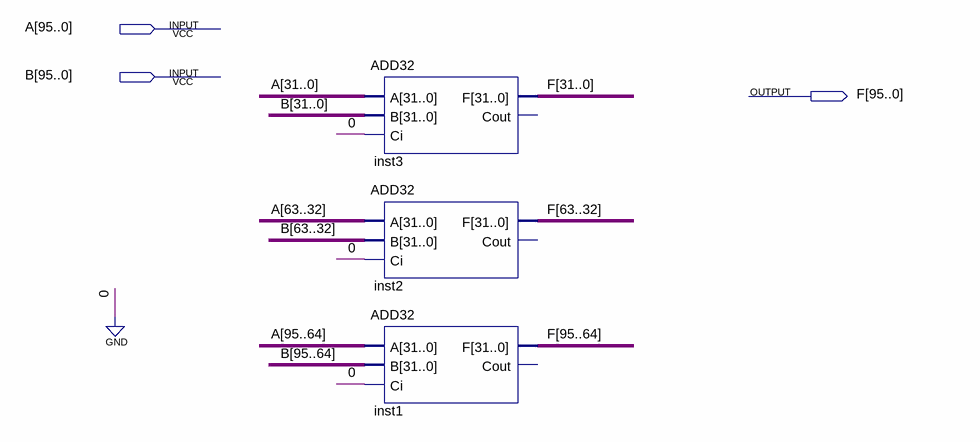
[diagram p0: schematic sheet]
// Quartus schematic vec3_add.bdf as structural Verilog: 3 symbols, 3 pins
module vec3_add (
  input  [95:0] A,
  input  [95:0] B,
  output [95:0] F
);

  ADD32 inst3 (.A(A[31:0]), .B(B[31:0]), .Ci(1'b0), .F(F[31:0]));  // open: Cout
  ADD32 inst2 (.A(A[63:32]), .B(B[63:32]), .Ci(1'b0), .F(F[63:32]));  // open: Cout
  ADD32 inst1 (.A(A[95:64]), .B(B[95:64]), .Ci(1'b0), .F(F[95:64]));  // open: Cout
endmodule
